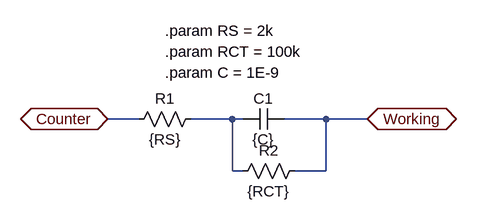
[diagram p0: schematic Ideal_Randles.asc]
Ideal_Randles.asc, the LTspice schematic file:
Version 4
SHEET 1 880 680
WIRE 48 128 0 128
WIRE 192 128 128 128
WIRE 208 128 192 128
WIRE 336 128 272 128
WIRE 400 128 336 128
WIRE 192 208 192 128
WIRE 208 208 192 208
WIRE 336 208 336 128
WIRE 336 208 288 208
FLAG 400 128 Working
IOPIN 400 128 BiDir
FLAG 0 128 Counter
IOPIN 0 128 BiDir
SYMBOL res 144 112 R90
WINDOW 0 0 56 VBottom 2
WINDOW 3 32 56 VTop 2
SYMATTR InstName R1
SYMATTR Value {RS}
SYMBOL res 304 192 R90
WINDOW 0 0 56 VBottom 2
WINDOW 3 32 56 VTop 2
SYMATTR InstName R2
SYMATTR Value {RCT}
SYMBOL cap 272 112 R90
WINDOW 0 0 32 VBottom 2
WINDOW 3 32 32 VTop 2
SYMATTR InstName C1
SYMATTR Value {C}
TEXT 88 -8 Left 2 !.param RS = 2k
TEXT 88 24 Left 2 !.param RCT = 100k
TEXT 88 56 Left 2 !.param C = 1E-9

The netlist it stands for:
* Ideal_Randles.asc
R1 N001 Counter {RS}
R2 Working N001 {RCT}
C1 Working N001 {C}
.param RS = 2k
.param RCT = 100k
.param C = 1E-9
.backanno
.end